# Altium schematic sheet main.SchDoc
size A4
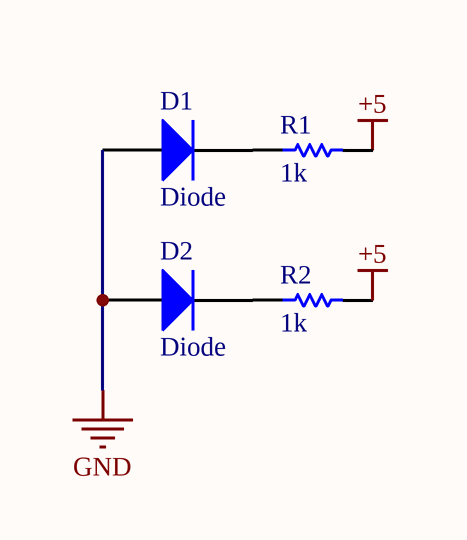
[diagram p0: main.SchDoc]

## Parts
D1  Diode  [LED3mm]
D2  Diode  [LED3mm]
R1  1k  [RR_0603]
R2  1k  [RR_0603]

## Nets
+5: R1.2 R2.2
GND: D1.1(A) D2.1(A)
NetD1_2: D1.2(K) R1.1
NetD2_2: D2.2(K) R2.1

## Library data of the parts
D1 D2 = Diode: Default Diode; Published: 8-Jun-2000; LatestRevisionDate: 17-Jul-2002; LatestRevisionNote: Re-released for DXP Platform.; PackageVersion: Sep-1996; PackageReference: SMC; Publisher: Altium Limited; PackageDescription: DO-214-AB/SMC; 2 C-Bend Leads; Body 7.9 x 5.9 mm, inc. leads (LxW); Code_JEDEC: DO-214-AB
R1 R2 = Res1: Resistor